# EAGLE design man_actuation_board_2..4 (EAGLE 6.4)
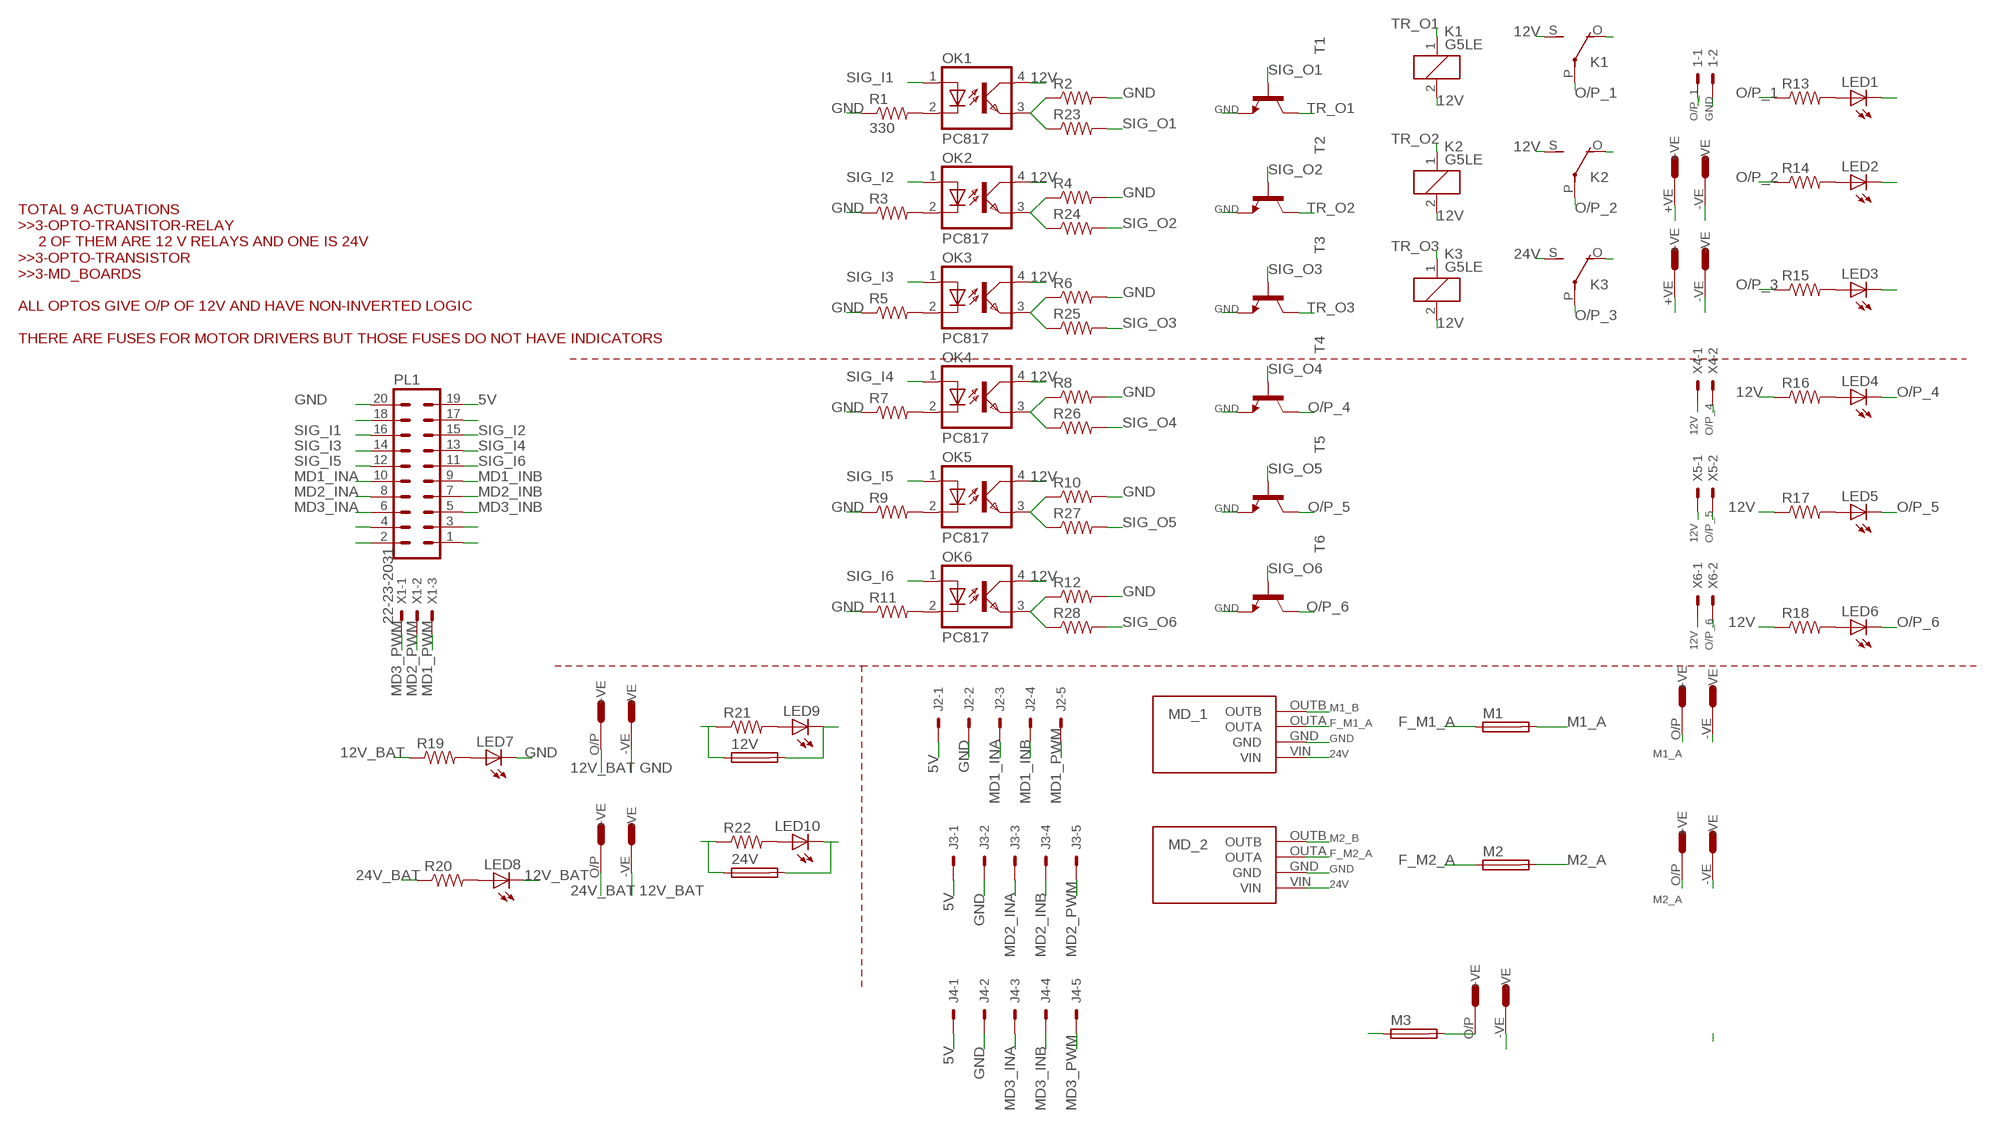
[diagram p0: schematic, sheet 1]

## Parts
0-12_BAT  MOLEX_4  [MOLEX_2K14]
1  1  22-23-2021  [22-23-2021]
12-24_I/P  MOLEX_4  [MOLEX_2K14]
12V  SH25  [SH25]
24V  SH25  [SH25]
J2  22-27-2051-05  [6410-05]
J3  22-27-2051-05  [6410-05]
J4  22-27-2051-05  [6410-05]
K1  G5LE  [G5LE]
K2  G5LE  [G5LE]
K3  G5LE  [G5LE]
LED1  LED1206  [LED-1206]
LED2  LED1206  [LED-1206]
LED3  LED1206  [LED-1206]
LED4  LED1206  [LED-1206]
LED5  LED1206  [LED-1206]
LED6  LED1206  [LED-1206]
LED7  LED1206  [LED-1206]
LED8  LED1206  [LED-1206]
LED9  LED1206  [LED-1206]
LED10  LED1206  [LED-1206]
M1  SH25  [SH25]
M2  SH25  [SH25]
M3  SH25  [SH25]
MD_1  MOTOR_DRIVER  [MOTOR_DRIVER]
MD_2  MOTOR_DRIVER  [MOTOR_DRIVER]
OK1  PC817  [DIL04]
OK2  PC817  [DIL04]
OK3  PC817  [DIL04]
OK4  PC817  [DIL04]
OK5  PC817  [DIL04]
OK6  PC817  [DIL04]
PL1  ML20ML20  [ML20]
R1  330  RESISTOR1206  [1206]
R2  RESISTOR1206  [1206]
R3  RESISTOR1206  [1206]
R4  RESISTOR1206  [1206]
R5  RESISTOR1206  [1206]
R6  RESISTOR1206  [1206]
R7  RESISTOR1206  [1206]
R8  RESISTOR1206  [1206]
R9  RESISTOR1206  [1206]
R10  RESISTOR1206  [1206]
R11  RESISTOR1206  [1206]
R12  RESISTOR1206  [1206]
R13  RESISTOR1206  [1206]
R14  RESISTOR1206  [1206]
R15  RESISTOR1206  [1206]
R16  RESISTOR1206  [1206]
R17  RESISTOR1206  [1206]
R18  RESISTOR1206  [1206]
R19  RESISTOR1206  [1206]
R20  RESISTOR1206  [1206]
R21  RESISTOR1206  [1206]
R22  RESISTOR1206  [1206]
R23  RESISTOR1206  [1206]
R24  RESISTOR1206  [1206]
R25  RESISTOR1206  [1206]
R26  RESISTOR1206  [1206]
R27  RESISTOR1206  [1206]
R28  RESISTOR1206  [1206]
T1  -NPN-TO5  [TO5]
T2  -NPN-TO5  [TO5]
T3  -NPN-TO5  [TO5]
T4  -NPN-TO5  [TO5]
T5  -NPN-TO5  [TO5]
T6  -NPN-TO5  [TO5]
U$1  MOLEX_4  [MOLEX_2K14]
U$2  MOLEX_4  [MOLEX_2K14]
U$3  MOLEX_4  [MOLEX_2K14]
U$4  MOLEXM  [MOLEX_2K13]
U$5  MOLEXM  [MOLEX_2K13]
X1  22-23-2031  [22-23-2031]
X4  4  22-23-2021  [22-23-2021]
X5  5  22-23-2021  [22-23-2021]
X6  6  22-23-2021  [22-23-2021]

## Nets
5V: J2.1 J3.1 J4.1 PL1.19
12V [power_12]: 12V.2 K1.2 K1.S(2:S) K2.2 K2.S(2:S) K3.2 LED9.C OK1.4(COL) OK2.4(COL) OK3.4(COL) OK4.4(COL) OK5.4(COL) OK6.4(COL) R16.1 R17.1 R18.1 X4.1 X5.1 X6.1
12V_BAT [power_24]: 0-12_BAT.O/P(+VE) 12-24_I/P.-VE 12V.1 LED8.C R19.1 R21.1
12V_M: M3.2 U$3.O/P(+VE)
24V [power_24]: 24V.2 K3.S(2:S) LED10.C M3.1 MD_1.VIN MD_2.VIN
24V_BAT [power_24]: 12-24_I/P.O/P(+VE) 24V.1 R20.1 R22.1
F_M1_A [motor]: M1.1 MD_1.OUTA
F_M2_A [motor]: M2.1 MD_2.OUTA
GND [power_24]: 0-12_BAT.-VE 1.2 J2.2 J3.2 J4.2 LED1.C LED2.C LED3.C LED7.C MD_1.GND MD_2.GND PL1.20 R1.1 R2.2 R3.1 R4.2 R5.1 R6.2 R7.1 R8.2 R9.1 R10.2 R11.1 R12.2 T1.1(E) T2.1(E) T3.1(E) T4.1(E) T5.1(E) T6.1(E) U$3.-VE U$4.-VE U$5.-VE
M1_A [motor]: M1.2 U$1.O/P(+VE)
M1_B [motor]: MD_1.OUTB U$1.-VE
M2_A [motor]: M2.2 U$2.O/P(+VE)
M2_B [motor]: MD_2.OUTB U$2.-VE
MD1_INA: J2.3 PL1.10
MD1_INB: J2.4 PL1.9
MD1_PWM: J2.5 X1.3
MD2_INA: J3.3 PL1.8
MD2_INB: J3.4 PL1.7
MD2_PWM: J3.5 X1.2
MD3_INA: J4.3 PL1.6
MD3_INB: J4.4 PL1.5
MD3_PWM: J4.5 X1.1
N$1: OK1.2(C) R1.2
N$2 [power_24]: LED1.A R13.2
N$3 [power_24]: LED2.A R14.2
N$4: OK2.2(C) R3.2
N$5 [power_24]: LED3.A R15.2
N$6 [power_24]: LED4.A R16.2
N$7 [power_24]: LED5.A R17.2
N$8 [power_24]: LED6.A R18.2
N$9 [power_24]: LED7.A R19.2
N$10: OK3.2(C) R5.2
N$11 [power_24]: LED8.A R20.2
N$12: PL1.1
N$13: PL1.18
N$14: K1.O(2:O)
N$15: PL1.2
N$16: OK4.2(C) R7.2
N$17: PL1.4
N$18 [power_24]: LED9.A R21.2
N$19: K2.O(2:O)
N$20 [power_24]: LED10.A R22.2
N$22: K3.O(2:O)
N$23: OK5.2(C) R9.2
N$24: OK1.3(EMIT) R2.1 R23.1
N$25: OK2.3(EMIT) R4.1 R24.1
N$26: OK3.3(EMIT) R6.1 R25.1
N$27: OK4.3(EMIT) R8.1 R26.1
N$28: OK5.3(EMIT) R10.1 R27.1
N$29: OK6.3(EMIT) R12.1 R28.1
N$30: OK6.2(C) R11.2
N$32: PL1.17
N$39: PL1.3
O/P_1 [piston]: 1.1 K1.P(2:P) R13.1
O/P_2 [piston]: K2.P(2:P) R14.1 U$5.+VE
O/P_3 [piston]: K3.P(2:P) R15.1 U$4.+VE
O/P_4: LED4.C T4.3(C) X4.2
O/P_5: LED5.C T5.3(C) X5.2
O/P_6: LED6.C T6.3(C) X6.2
SIG_I1: OK1.1(A) PL1.16
SIG_I2: OK2.1(A) PL1.15
SIG_I3: OK3.1(A) PL1.14
SIG_I4: OK4.1(A) PL1.13
SIG_I5: OK5.1(A) PL1.12
SIG_I6: OK6.1(A) PL1.11
SIG_O1: R23.2 T1.2(B)
SIG_O2: R24.2 T2.2(B)
SIG_O3: R25.2 T3.2(B)
SIG_O4: R26.2 T4.2(B)
SIG_O5: R27.2 T5.2(B)
SIG_O6: R28.2 T6.2(B)
TR_O1: K1.1 T1.3(C)
TR_O2: K2.1 T2.3(C)
TR_O3: K3.1 T3.3(C)

## Notes on the sheet
- TOTAL 9 ACTUATIONS
  >>3-OPTO-TRANSITOR-RELAY
       2 OF THEM ARE 12 V RELAYS AND ONE IS 24V 
  >>3-OPTO-TRANSISTOR
  >>3-MD_BOARDS
  
  ALL OPTOS GIVE O/P OF 12V AND HAVE NON-INVERTED LOGIC
  
  THERE ARE FUSES FOR MOTOR DRIVERS BUT THOSE FUSES DO NOT HAVE INDICATORS

## Library data of the parts
0-12_BAT 12-24_I/P U$1-U$3 = Robocon2k14:MOLEX_4
1 X4-X6 = con-molex:22-23-2021: .100" (2.54mm) Center Header - 2 Pin; MF: MOLEX; MPN: 22-23-2021; OC_FARNELL: 1462926; OC_NEWARK: 25C3832
12V 24V M1-M3 = fuse:SH25: FUSE HOLDER grid 25 mm, OGN0031 8211, Schurter (Buerklin); MF: SCHURTER; MPN: 0031.8211; OC_FARNELL: 1162741; OC_NEWARK: 96B9380
J2-J4 = con-molex:22-?-05: CONNECTOR wire to board 2.54 mm (.1 inch) pitch header; OC_FARNELL: unknown; OC_NEWARK: unknown
K1-K3 = relay:G5LE: RELAY 1 x switch, 10 A/120 V AC, 8 A/30 V DC, Omron; OC_FARNELL: unknown; OC_NEWARK: unknown
LED1-LED10 = SparkFun-LED:LED: LEDs Standard schematic elements and footprints for 5mm, 3mm, 1206, and 0603 sized LEDs. 5mm - Spark Fun Electronics SKU : COM-00529 (and others)
MD_1 MD_2 = Robocon2k14:MOTOR_DRIVER
OK1-OK6 = optocoupler:PC817: SHARP OPTO COUPLER; MPN: PC817X4J000F; OC_FARNELL: 9707727; OC_NEWARK: 97K7059
PL1 = Robocon2k14:ML20: HARTING; OC_FARNELL: unknown; OC_NEWARK: unknown
R1-R28 = SparkFun-Passives:RESISTOR: Resistor Basic schematic elements and footprints for 0603, 1206, and PTH resistors.
T1-T6 = transistor:*-NPN-: NPN Transistror BF959 corrected 2008.03.06
U$4 U$5 = Robocon2k14:MOLEX
X1 = Robocon2k14:22-23-2031: .100" (2.54mm) Center Header - 3 Pin; MF: MOLEX; MPN: 22-23-2031; OC_FARNELL: 1462950; OC_NEWARK: 30C0862

## Net classes
0 default: width 0.61 mm, clearance 0.762 mm
1 power_24: width 2.032 mm, clearance 0.762 mm
2 motor: width 2.032 mm, clearance 0.762 mm
3 piston: width 0.61 mm, clearance 0.61 mm
4 power_12: width 1.016 mm, clearance 0.61 mm

## Board
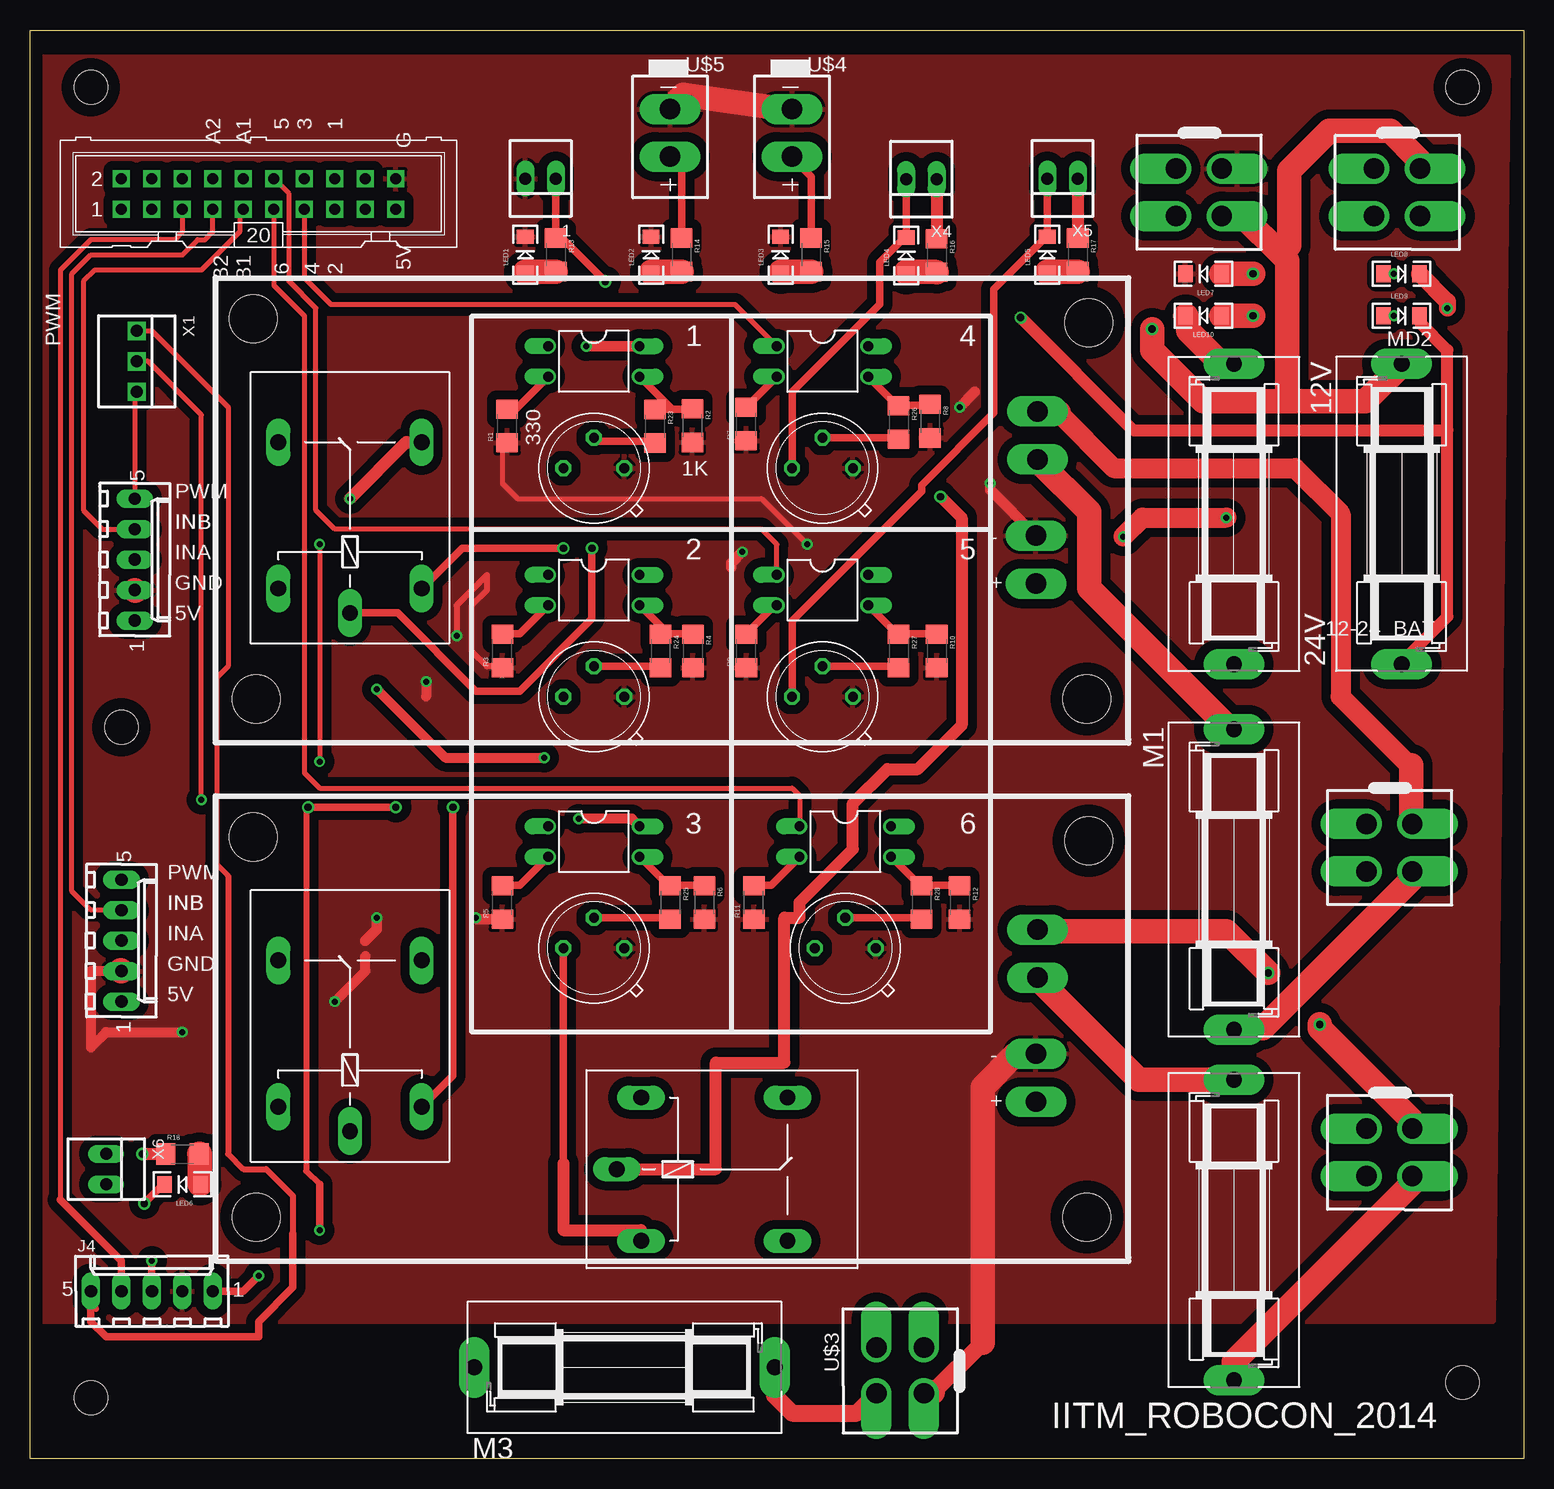
[diagram p1: board, top side]
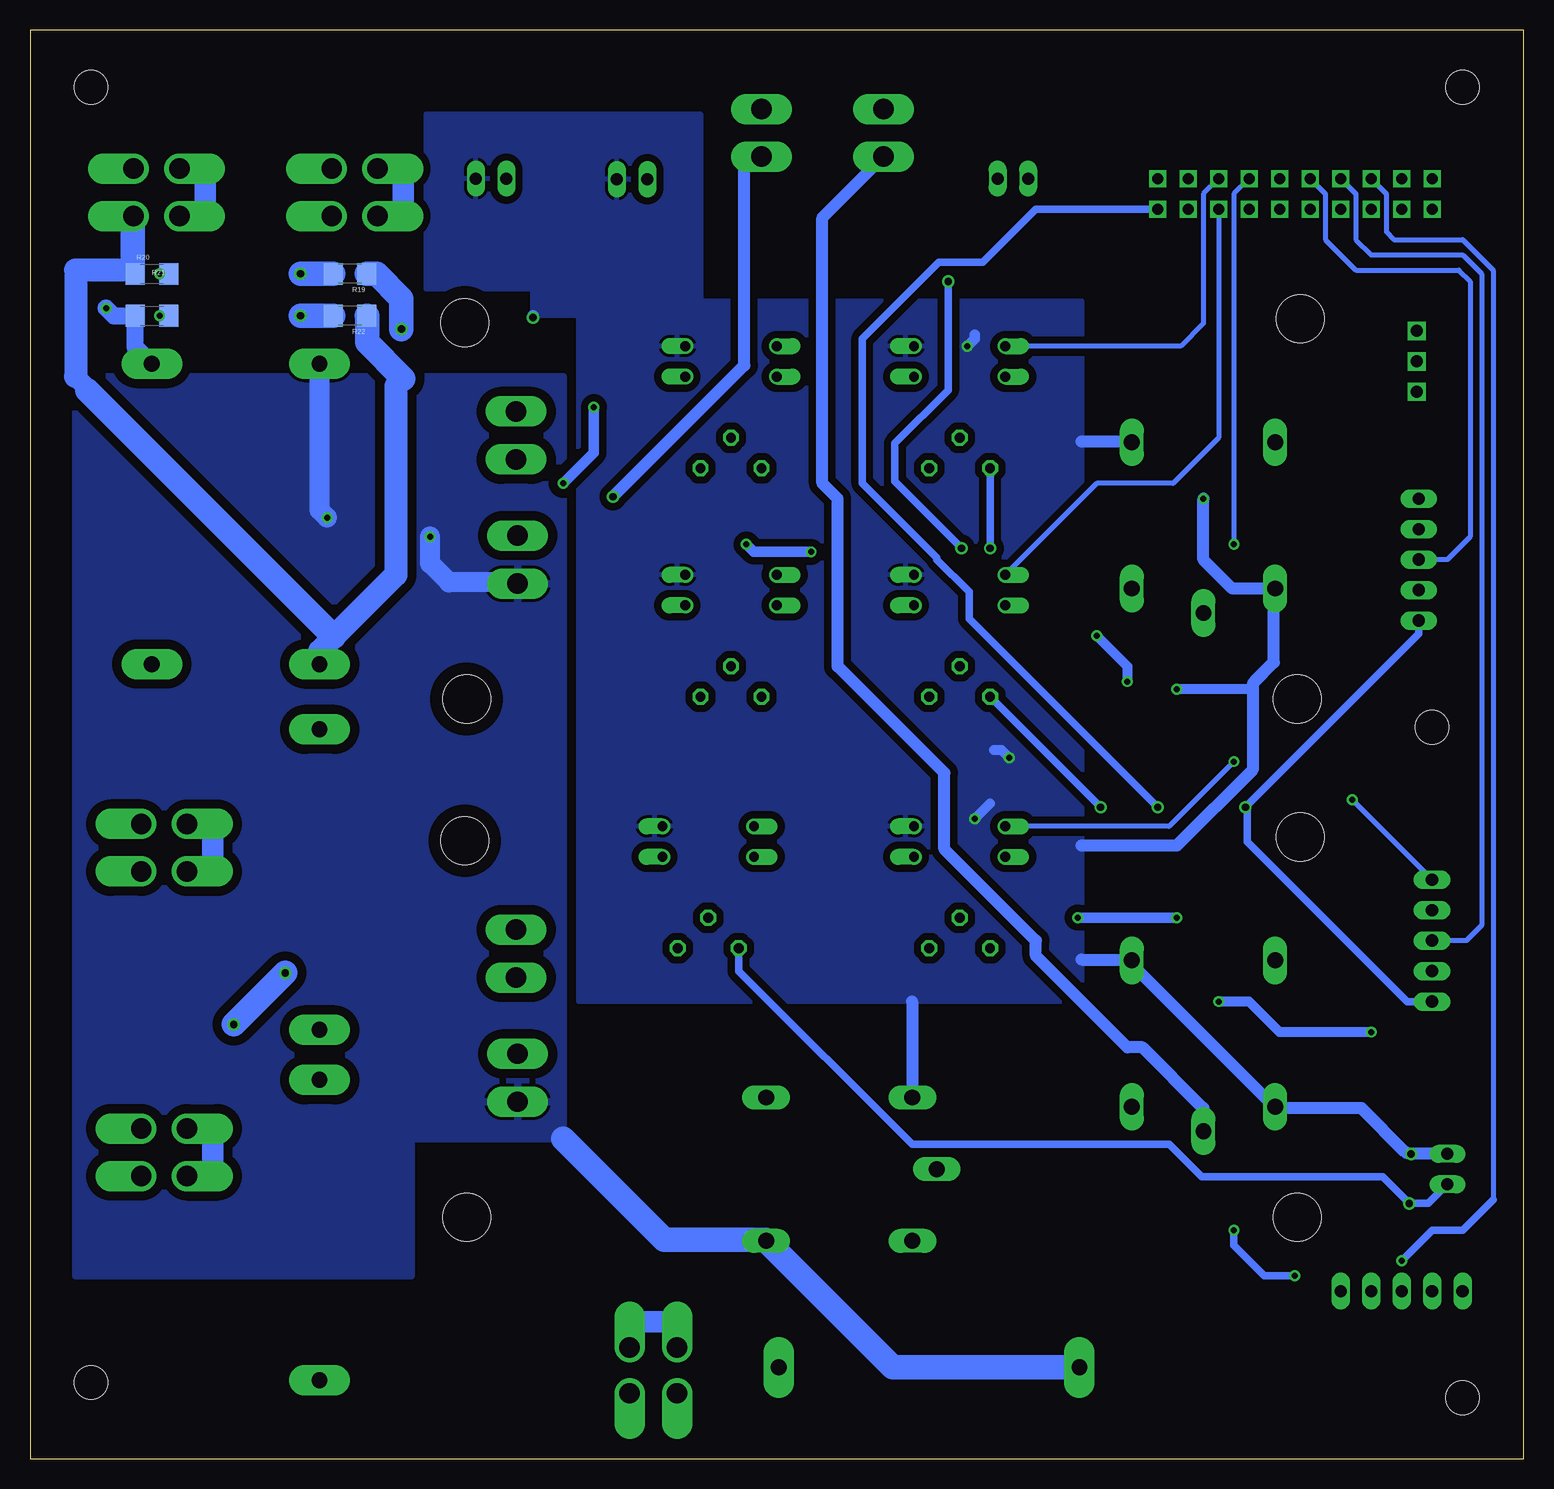
[diagram p2: board, bottom side, seen from below]

Size 124.46 x 119.06 mm. Coordinates in mm from the lower left corner, seen from the top.
Outline: 0,119.06 124.46,119.06 124.46,0 0,0 0,119.06
Copper layers (1*16): Top 0.035mm / dielectric 1.5mm / Bottom 0.035mm
Design rules "default *": minimum track width 10mil, minimum drill 24mil, track to track 15mil, track to pad 15mil, pad to pad 15mil, via to via 15mil, smd to smd 8mil, copper to edge 40mil, drill to drill 8mil, minimum pad ring 10mil, minimum via ring 8mil, stop-mask expansion 4mil, vias tented up to drill 0mil, thermal gap 10mil
Holes 2.8 mm at 5.08,5.08 119.38,6.35 119.38,114.3 7.62,60.96 5.08,114.3

### Footprints (pad centres in the part's own frame; a part is rotated, then mirrored left to right if it is on the bottom)
MOLEX_2K14 = drill 1.7 pad 2.184 offset: " 1.651,1.853; -VE -2.159,-2.107; I/P 1.651,-2.107; O/P -2.159,1.853
22-23-2021 = drill 1 long: 1 -1.27,0; 2 1.27,0
SH25 = drill 1.321 pad 2.54 long: 1 -12.522,0; 2 12.522,0
6410-05 = drill 1.016 long: 1 5.08,0; 2 2.54,0; 3 0,0; 4 -2.54,0; 5 -5.08,0
G5LE = drill 1.321 long: 1 -7.493,-5.969; 2 -7.493,5.969; O 4.699,5.969; P -9.525,0; S 4.699,-5.969
LED-1206 = smd 1.2 x 1.4: A -1.5,0; C 1.5,0
MOTOR_DRIVER = drill 1.7 pad 2.184 long: GND 30.48,-3.08; OUTA 30.607,3.271; OUTB 30.607,7.271; VIN 30.48,-7.08 | hole 4: -34.734,14.986; -34.48,-16.7; 34.735,-16.7; 34.893,14.669
DIL04 = drill 0.813 offset: 1 -1.27,-3.81; 2 1.27,-3.81; 3 1.27,3.81; 4 -1.27,3.81
ML20 = drill 0.914 square: 1 -11.43,-1.27; 2 -11.43,1.27; 3 -8.89,-1.27; 4 -8.89,1.27; 5 -6.35,-1.27; 6 -6.35,1.27; 7 -3.81,-1.27; 8 -3.81,1.27; 9 -1.27,-1.27; 10 -1.27,1.27; 11 1.27,-1.27; 12 1.27,1.27; 13 3.81,-1.27; 14 3.81,1.27; 15 6.35,-1.27; 16 6.35,1.27; 17 8.89,-1.27; 18 8.89,1.27; 19 11.43,-1.27; 20 11.43,1.27
1206 = smd 1.6 x 1.8: 1 -1.4,0; 2 1.4,0
TO5 = drill 0.813 octagon: 1 0,-2.54; 2 2.54,0; 3 0,2.54
MOLEX_2K13 = drill 1.7 pad 2.184 long: +VE 0,-1.98; -VE 0,1.98
22-23-2031 = drill 1 square: 1 -2.54,0; 2 0,0; 3 2.54,0

### Placement (x,y rotation side)
0-12_BAT  97.16,105.41 180 top
1  42.55,106.68 180 top
12-24_I/P  113.67,105.41 180 top
12V  114.3,78.74 270 top
24V  100.33,78.74 90 top
J2  8.73,74.93 270 top
J3  7.62,43.18 270 top
J4  10.16,13.97 0 top
K1  26.67,80.01 90 top
K2  26.67,36.83 90 top
K3  58.42,24.13 0 top
LED1  41.28,100.33 90 top
LED2  51.75,100.33 90 top
LED3  62.55,100.33 90 top
LED4  73.01,100.27 90 top
LED5  84.77,100.33 90 top
LED6  12.7,22.86 180 top
LED7  97.79,98.74 180 top
LED8  114.3,98.74 0 top
LED9  114.3,95.25 0 top
LED10  97.79,95.25 180 top
M1  100.33,48.26 270 top
M2  100.33,19.05 270 top
M3  49.53,7.62 0 top
MD_1  53.34,80.01 0 top
MD_2  53.34,36.83 0 top
OK1  46.99,91.44 270 top
OK2  46.99,72.39 270 top
OK3  46.99,51.44 270 top
OK4  66.04,91.44 270 top
OK5  66.04,72.39 270 top
OK6  67.94,51.44 270 top
PL1  19.05,105.41 0 top
R1  39.76,86.06 90 top
R2  55.19,86.09 270 top
R3  39.37,67.31 90 top
R4  55.25,67.31 270 top
R5  39.37,46.35 90 top
R6  56.2,46.35 270 top
R7  59.68,86.22 90 top
R8  75,86.47 270 top
R9  59.69,67.31 90 top
R10  75.56,67.31 270 top
R11  60.33,46.35 90 top
R12  77.47,46.35 270 top
R13  43.81,100.33 270 top
R14  54.29,100.33 270 top
R15  65.09,100.33 270 top
R16  75.55,100.27 270 top
R17  87.31,100.33 270 top
R18  12.7,25.4 0 top
R19  97.79,98.74 180 bottom
R20  114.3,98.74 0 bottom
R21  114.3,95.25 0 bottom
R22  97.79,95.25 180 bottom
R23  52.07,86.04 270 top
R24  52.55,67.31 270 top
R25  53.34,46.35 270 top
R26  72.39,86.36 270 top
R27  72.39,67.31 270 top
R28  74.3,46.35 270 top
T1  46.99,82.55 90 top
T2  46.99,63.5 90 top
T3  46.99,42.55 90 top
T4  66.04,82.55 90 top
T5  66.04,63.5 90 top
T6  67.94,42.55 90 top
U$1  113.03,50.8 180 top
U$2  113.03,25.4 180 top
U$3  72.39,7.62 90 top
U$4  63.5,110.49 0 top
U$5  53.34,110.49 0 top
X1  8.89,91.44 270 top
X4  74.28,106.62 180 top
X5  86.04,106.68 180 top
X6  6.35,24.13 270 top

### Tracks (layer width: path | path; a pad name or v marks a point on that pad's centre or on a via)
5V  (via drill 0.5, 0.61)
  Top 0.508: 23.02,54.13 23.02,23.97 24.13,22.86
  Top 0.61: v30.48,54.29 v23.18,54.29 23.02,54.13 | J4.1 17.78,13.97 v19.05,15.24 | 24.13,22.86 v24.13,19.05
  Bottom 0.61: PL1.19 40.64,104.14 45.09,99.7 48.74,99.7 55.09,93.35 55.09,81.28 48.89,75.09 48.89,74.93 46.2,72.23 46.2,70.01 v30.48,54.29 | J2.1 8.73,68.74 v23.18,54.29 23.02,54.13 23.02,51.44 9.68,38.1 J3.1 | v19.05,15.24 21.59,15.24 24.13,17.78 v24.13,19.05
12V  (via drill 0.5, 0.61)
  Top 0.813: v28.89,64.14 34.61,58.42 v42.86,58.42 | OK3.4 50.16,53.34 v45.72,53.34
  Top 0.889: OK1.4 v46.36,92.71
  Top 1.016: 118.11,85.73 118.11,70.17 114.3,66.36 12V.2 | 118.11,85.73 118.11,92.39 115.89,94.62 115.89,95.25 LED9.C | v9.37,25.4 R18.1 | R16.1 75.56,101.76 75.56,106.52 X4.1 | X5.1 R17.1 | 118.11,85.73 91.92,85.73 v82.55,95.09 | v26.67,80.01 31.37,84.71 K1.S
  Bottom 0.406: 20.96,66.68 20.64,66.99 20.64,72.45 K1.2 20.96,72.26 20.96,66.68 | 20.96,66.68 22.54,65.09 22.54,64.14
  Bottom 0.813: 22.54,64.14 v28.89,64.14 | v42.86,58.42 43.5,59.05 44.13,59.05 | v45.72,53.34 44.45,54.61
  Bottom 0.889: v46.36,92.71 45.72,93.35 45.72,93.66
  Bottom 1.016: X6.1 v9.37,25.4 9.84,25.56 13.49,29.21 20.64,29.21 K2.2 21.11,29.69 32.54,41.12 K2.S 32.7,41.59 36.83,41.59 | 36.83,51.12 28.89,51.12 22.54,57.47 22.54,64.14 22.54,64.61 20.8,66.36 20.8,72.39 K1.2 24.26,72.52 26.67,74.93 v26.67,80.01 | 36.83,84.77 32.7,84.77 K1.S | 50.96,38.1 50.96,30.16 K3.2 | v82.55,95.09 82.55,95.25 | 72.55,52.7 72.55,52.86 OK6.4
  pour Bottom: 68.58,111.76 68.58,96.52 36.83,96.52 36.83,38.1 78.74,38.1 78.74,95.25 82.55,95.25 82.55,96.52 82.55,97.47 91.44,97.47 91.44,112.08 68.58,112.08
12V_BAT  (via drill 0.5, 0.61)
  Top 1.422: LED8.C 118.11,96.43 v118.11,95.89
  Top 2.032: v93.5,94.14 93.5,92.39 97.79,88.11 104.78,88.11 | 104.78,88.11 111.28,88.11 114.3,91.12 12V.1 | 104.22,100.41 104.78,99.85 104.78,88.11 | 104.22,100.41 101.12,103.51 99.38,103.51 0-12_BAT.O/P | 12-24_I/P.-VE 115.73,107.63 115.73,108.27 113.35,110.65 108.27,110.65 104.93,107.32 104.93,101.12 104.22,100.41
  Bottom 1.422: 12V.1 115.7,92.66 R21.1 117.47,95.25 v118.11,95.89
  Bottom 2.032: R19.1 95.57,98.74 93.5,96.68 v93.5,94.14
12V_M
  Top 0.61: 70.48,5.56 U$3.O/P
  Top 1.422: M3.2 62.05,5.26 63.5,3.81 68.89,3.81 U$3.O/P
24V  (via drill 0.5)
  Top 1.676: v91.12,76.84 92.71,78.42 v99.7,78.42
  Top 2.032: LED10.C 96.36,95.25 96.36,94.93 96.52,94.77 96.52,93.98 99.22,91.28 100.33,91.28 24V.2
  Bottom 1.676: MD_1.VIN 83.92,73.03 89.53,73.03 91.12,74.61 v91.12,76.84 | v99.7,78.42 100.33,79.06 24V.2
  Bottom 2.032: 80.01,26.67 71.6,18.26 63.18,18.26 K3.S 62.39,17.46 52.55,7.62 M3.1
  pour Bottom: 120.65,90.17 80.01,90.17 80.01,26.67 92.71,26.67 92.71,15.24 120.65,15.24
24V_BAT
  Top 2.032: 100.33,66.36 24V.1
  Bottom 1.422: R20.1 115.89,98.93 115.89,99.38
  Bottom 1.676: 120.65,90.17 119.7,89.22 119.7,89.06
  Bottom 1.93: 115.89,99.38 116.2,99.06 120.65,99.06 120.65,90.17 | 93.34,90.01 93.98,89.38 93.98,73.66 99.14,68.5 100.33,67.31 24V.1
  Bottom 2.032: 93.34,90.01 96.36,93.03 96.36,95.25 R22.1 | 115.89,99.38 115.89,103.51 12-24_I/P.O/P | 99.14,68.5 119.7,89.06
F_M1_A
  Top 2.032: M1.1 100.33,60.8 100.01,60.8 88.27,72.55 88.27,78.9 83.98,83.19 MD_1.OUTA
F_M2_A
  Top 2.032: M2.1 100.33,31.59 92.39,31.59 83.98,40.01 MD_2.OUTA
GND  (via drill 0.5)
  Top 0.406: R1.1 39.37,84.28 39.37,81.28 40.64,80.01 60.96,80.01 v64.77,76.2
  Top 0.508: R3.1 39.24,66.04 38.1,66.04 36.83,67.31 36.83,71.12 38.1,72.39 38.1,73.66 35.56,71.12 v35.56,68.58
  Top 0.813: 7.57,40.69 7.52,40.64 5.08,40.64 5.08,34.29 6.35,35.56 v12.7,35.56 | v25.4,38.1 27.94,40.64 27.94,41.91 | v33.02,64.77 33.02,63.5
  Top 0.889: v59.37,75.57 58.42,74.61 58.42,74.3 | MD_1.GND 80.01,80.74 v80.01,81.28 | v77.47,87.63 78.74,88.9 | R5.1 37.28,44.95 v37.15,45.09 | v28.89,45.09 28.89,44.13 27.94,43.18
  Top 1.422: 79.38,9.68 75.25,5.56
  Top 2.032: J3.2 7.57,40.69 | J2.2 8.78,72.34 | 75.25,5.56 74.61,5.56 U$3.-VE | 79.38,9.68 79.38,30.96 82.07,33.66 83.82,33.66 MD_2.GND | U$4.-VE 63.5,112.4 54.45,113.67 53.34,112.55 U$5.-VE
  Bottom 0.813: v12.7,35.56 20.32,35.56 22.86,38.1 v25.4,38.1 | v35.56,68.58 33.02,66.04 v33.02,64.77
  Bottom 0.889: v64.77,76.2 64.13,75.57 v59.37,75.57 | v80.01,81.28 77.47,83.82 v77.47,87.63 | v37.15,45.09 v28.89,45.09
  pour Top: 0,116.84 123.19,116.84 121.92,11.43 -1.27,11.43
M1_A
  Top 2.032: M1.2 100.33,35.88 102.71,35.88 115.09,48.26 115.09,48.89 U$1.O/P
M1_B
  Top 1.676: 85.72,87.15 90.33,82.55 105.41,82.55 109.22,78.74 109.22,63.5 115.09,57.63 115.09,57.15
  Top 2.032: 115.09,57.78 115.09,57.15 115.09,53.02 U$1.-VE | 85.72,87.15 83.98,87.15 MD_1.OUTB
M2_A
  Top 2.032: M2.2 100.33,8.1 115.09,22.86 115.09,23.49 U$2.O/P
M2_B  (via drill 0.61)
  Top 2.032: v103.19,40.48 99.7,43.97 83.98,43.97 MD_2.OUTB | v107.47,36.2 107.47,35.88 115.09,28.26 115.09,27.62 U$2.-VE
  Bottom 2.032: v107.47,36.2 v103.19,40.48
MD1_INA
  Bottom 0.406: PL1.10 16.51,105.41 16.51,101.6 13.97,99.06 5.4,99.06 4.45,98.11 4.45,76.84 6.35,74.93 J2.3
MD1_INB
  Top 0.406: PL1.9 17.46,103.82 17.46,102.23 14.29,99.06 5.4,99.06 4.45,98.11 4.45,79.06 6.03,77.47 J2.4
MD1_PWM
  Top 0.406: X1.3 8.73,88.74 J2.5
MD2_INA
  Bottom 0.406: PL1.8 13.97,105.41 13.97,101.6 12.7,100.33 5.08,100.33 3.49,98.74 3.49,44.45 4.76,43.18 J3.3
MD2_INB
  Top 0.406: J3.4 5.08,45.72 3.49,47.31 3.49,98.74 5.08,100.33 12.7,100.33 13.97,101.6 14.61,101.6 15.24,102.23 PL1.7
MD2_PWM  (via drill 0.5)
  Top 0.406: v14.29,54.93 14.29,87 9.84,91.44 X1.2
  Bottom 0.406: v14.29,54.93 J3.5
MD3_INA  (via drill 0.5)
  Top 0.61: J4.3 v10.16,16.51
  Bottom 0.406: PL1.6 11.43,105.41 11.43,102.23 10.8,101.6 5.08,101.6 2.54,99.06 2.54,21.59
  Bottom 0.61: v10.16,16.51 7.62,19.05 5.08,19.05 2.54,21.59
MD3_INB
  Top 0.406: PL1.5 12.7,102.23 12.07,101.6 5.08,101.6 2.54,99.06 2.54,21.59
  Top 0.61: 2.54,21.59 7.62,16.51 J4.4
MD3_PWM
  Top 0.406: X1.1 10.16,93.98 16.51,87.63 16.51,66.04 15.56,65.09 15.56,49.53 16.51,48.58
  Top 0.508: 5.51,12.46 J4.5 | 16.51,48.58 16.51,25.4 17.78,24.13 19.69,24.13 21.91,21.91 21.91,18.73
  Top 0.61: 21.91,18.73 21.91,14.29 19.05,11.43 19.05,10.16 6.35,10.16 5.08,11.43 J4.5
N$1
  Top 0.61: OK1.2 40.48,87.47 39.85,87.47 R1.2
N$2
  Top 2.032: LED1.A 41.28,98.9 43.81,98.9 R13.2
N$3
  Top 2.032: LED2.A 51.75,98.9 54.29,98.9 R14.2
N$4
  Top 0.61: OK2.2 40.8,68.74 39.37,68.74 R3.2
N$5
  Top 2.032: LED3.A 62.55,98.9 65.09,98.9 R15.2
N$6
  Top 2.032: LED4.A 73.03,98.9 75.41,98.9 R16.2
N$7
  Top 2.032: LED5.A 84.77,98.9 87.31,98.9 R17.2
N$8
  Top 2.032: LED6.A 14.13,22.86 14.13,25.4 R18.2
N$9  (via drill 0.61)
  Top 2.032: v101.92,98.74 LED7.A
  Bottom 2.032: R19.2 v101.92,98.74
N$10
  Top 0.61: OK3.2 40.8,47.78 39.37,47.78 R5.2
N$11  (via drill 0.5)
  Top 0.406: v113.67,98.74 LED8.A
  Bottom 0.406: R20.2 v113.67,98.74
N$16
  Top 0.61: OK4.2 R7.2
N$18  (via drill 0.5)
  Top 0.406: LED9.A v113.67,95.25
  Bottom 0.406: v113.67,95.25 R21.2
N$20  (via drill 0.61)
  Top 2.032: v101.92,95.25 LED10.A
  Bottom 2.032: R22.2 v101.92,95.25
N$23
  Top 0.61: OK5.2 62.07,71.12 59.69,68.74 R9.2
N$24
  Top 0.61: 53.34,87.47 55.09,87.47 R2.1 | 53.34,87.47 52.07,87.47 R23.1 | OK1.3 53.34,87.63 53.34,87.47
N$25
  Top 0.61: R4.1 55.25,68.74 52.55,68.74 R24.1 53.02,68.9 OK2.3
N$26
  Top 0.61: R6.1 56.2,47.78 53.34,47.78 R25.1 53.18,47.78 OK3.3
N$27
  Top 0.61: R8.1 74.93,87.79 72.39,87.79 R26.1 72.23,87.79 OK4.3
N$28
  Top 0.61: R10.1 75.56,68.74 72.39,68.74 R27.1 72.23,68.74 OK5.3
N$29
  Top 0.61: R12.1 77.47,47.78 74.3,47.78 R28.1 74.14,47.78 OK6.3
N$30
  Top 0.61: OK6.2 61.75,47.78 60.33,47.78 R11.2
O/P_1  (via drill 0.61)
  Top 0.61: 1.1 R13.1 43.97,102.08 v47.94,98.11 | K1.P 30.64,70.48 37.15,63.98 40.8,63.98 46.83,70.01 v46.83,75.88
  Bottom 0.61: v46.83,75.88 52.39,81.44 52.39,84.61 47.94,89.06 v47.94,98.11
O/P_2
  Top 0.61: R14.1 54.29,107.47 53.34,108.43 U$5.+VE
  Bottom 1.016: K2.P 26.67,29.21 31.75,34.29 33.02,34.29 40.64,41.91 40.64,43.18 48.26,50.8 48.26,57.15 57.15,66.04 57.15,80.01 58.42,81.28 58.42,103.43 U$5.+VE
O/P_3  (via drill 0.61)
  Top 0.61: R15.1 65.09,106.84 63.5,108.43 U$4.+VE
  Top 1.016: v75.88,80.17 77.63,78.42 77.63,61.12 73.98,57.47 71.44,57.47 68.58,54.61 68.58,50.8 64.13,46.35 64.13,45.09 62.87,45.09 62.87,33.02 57.15,33.02 57.15,24.13 K3.P
  Bottom 1.016: v75.88,80.17 64.93,91.12 64.93,107.79 63.5,109.22 U$4.+VE
O/P_4
  Top 0.61: X4.2 73.03,106.52 73.03,101.92 LED4.C 72.87,101.76 70.8,99.7 70.8,96.2 63.5,88.9 T4.3
O/P_5
  Top 0.61: X5.2 LED5.C 84.61,101.76 80.33,97.47 80.33,87.15 74.3,81.12 74.3,80.65 63.5,69.85 T5.3
O/P_6  (via drill 0.61)
  Top 0.61: v9.53,21.27 11.11,22.86 LED6.C
  Bottom 0.61: X6.2 7.94,21.27 v9.53,21.27 11.75,23.49 26.83,23.49 29.53,26.19 50.96,26.19 65.41,40.64 T6.3
SIG_I1
  Bottom 0.406: PL1.16 26.67,105.41 26.67,94.62 28.58,92.71 OK1.1
SIG_I2
  Bottom 0.406: PL1.15 25.4,85.09 29.21,81.28 35.56,81.28 OK2.1
SIG_I3  (via drill 0.5)
  Top 0.406: v24.13,76.2 v24.13,58.1
  Bottom 0.406: PL1.14 24.13,105.41 v24.13,76.2 | v24.13,58.1 29.53,52.7 OK3.1
SIG_I4
  Top 0.406: PL1.13 22.86,98.43 25.08,96.2 58.74,96.2 OK4.1
SIG_I5
  Top 0.406: OK5.1 62.23,76.2 60.96,77.47 25.4,77.47 23.81,79.06 23.81,95.89 21.59,98.11 21.59,105.41 PL1.12
SIG_I6
  Top 0.406: OK6.1 64.13,55.24 63.5,55.88 24.13,55.88 22.86,57.15 22.86,95.25 20.32,97.79 PL1.11
SIG_O1
  Top 0.61: T1.2 47.31,84.77 52.07,84.77 R23.2
SIG_O2
  Top 0.61: T2.2 52.55,66.04 R24.2
SIG_O3
  Top 0.61: T3.2 53.34,45.09 R25.2
SIG_O4
  Top 0.61: T4.2 72.39,85.09 R26.2
SIG_O5
  Top 0.61: T5.2 72.39,66.04 R27.2
SIG_O6
  Top 0.61: T6.2 74.3,45.09 R28.2
TR_O1  (via drill 0.61)
  Top 0.61: v44.45,75.88 36.04,75.88 32.7,72.55 K1.1
  Bottom 0.61: v44.45,75.88 T1.3
TR_O2  (via drill 0.61)
  Top 0.61: v35.24,54.29 35.24,31.91 32.7,29.37 K2.1
  Bottom 0.61: v35.24,54.29 T2.3
TR_O3
  Top 0.61: 44.45,24.61 T3.3 | 50.8,18.26 K3.1
  Top 1.016: 44.45,24.61 44.45,19.05 50.93,19.05 K3.1

### Text on the board
tPlace: A2 | A1 | 5 | 3 | 1 | G | B2 | B1 | 6 | 4 | 2 | 5V | PWM | 1 | 4 | MD2 | 330 | 1K | PWM | INB | INB | INA | 2 | 5 | GND | 5V | 12-24_BAT | 3 | 6 | PWM | INB | INB | INA | GND | 5V | IITM_ROBOCON_2014